# EAGLE design transistortester-mgr (EAGLE 5.07)
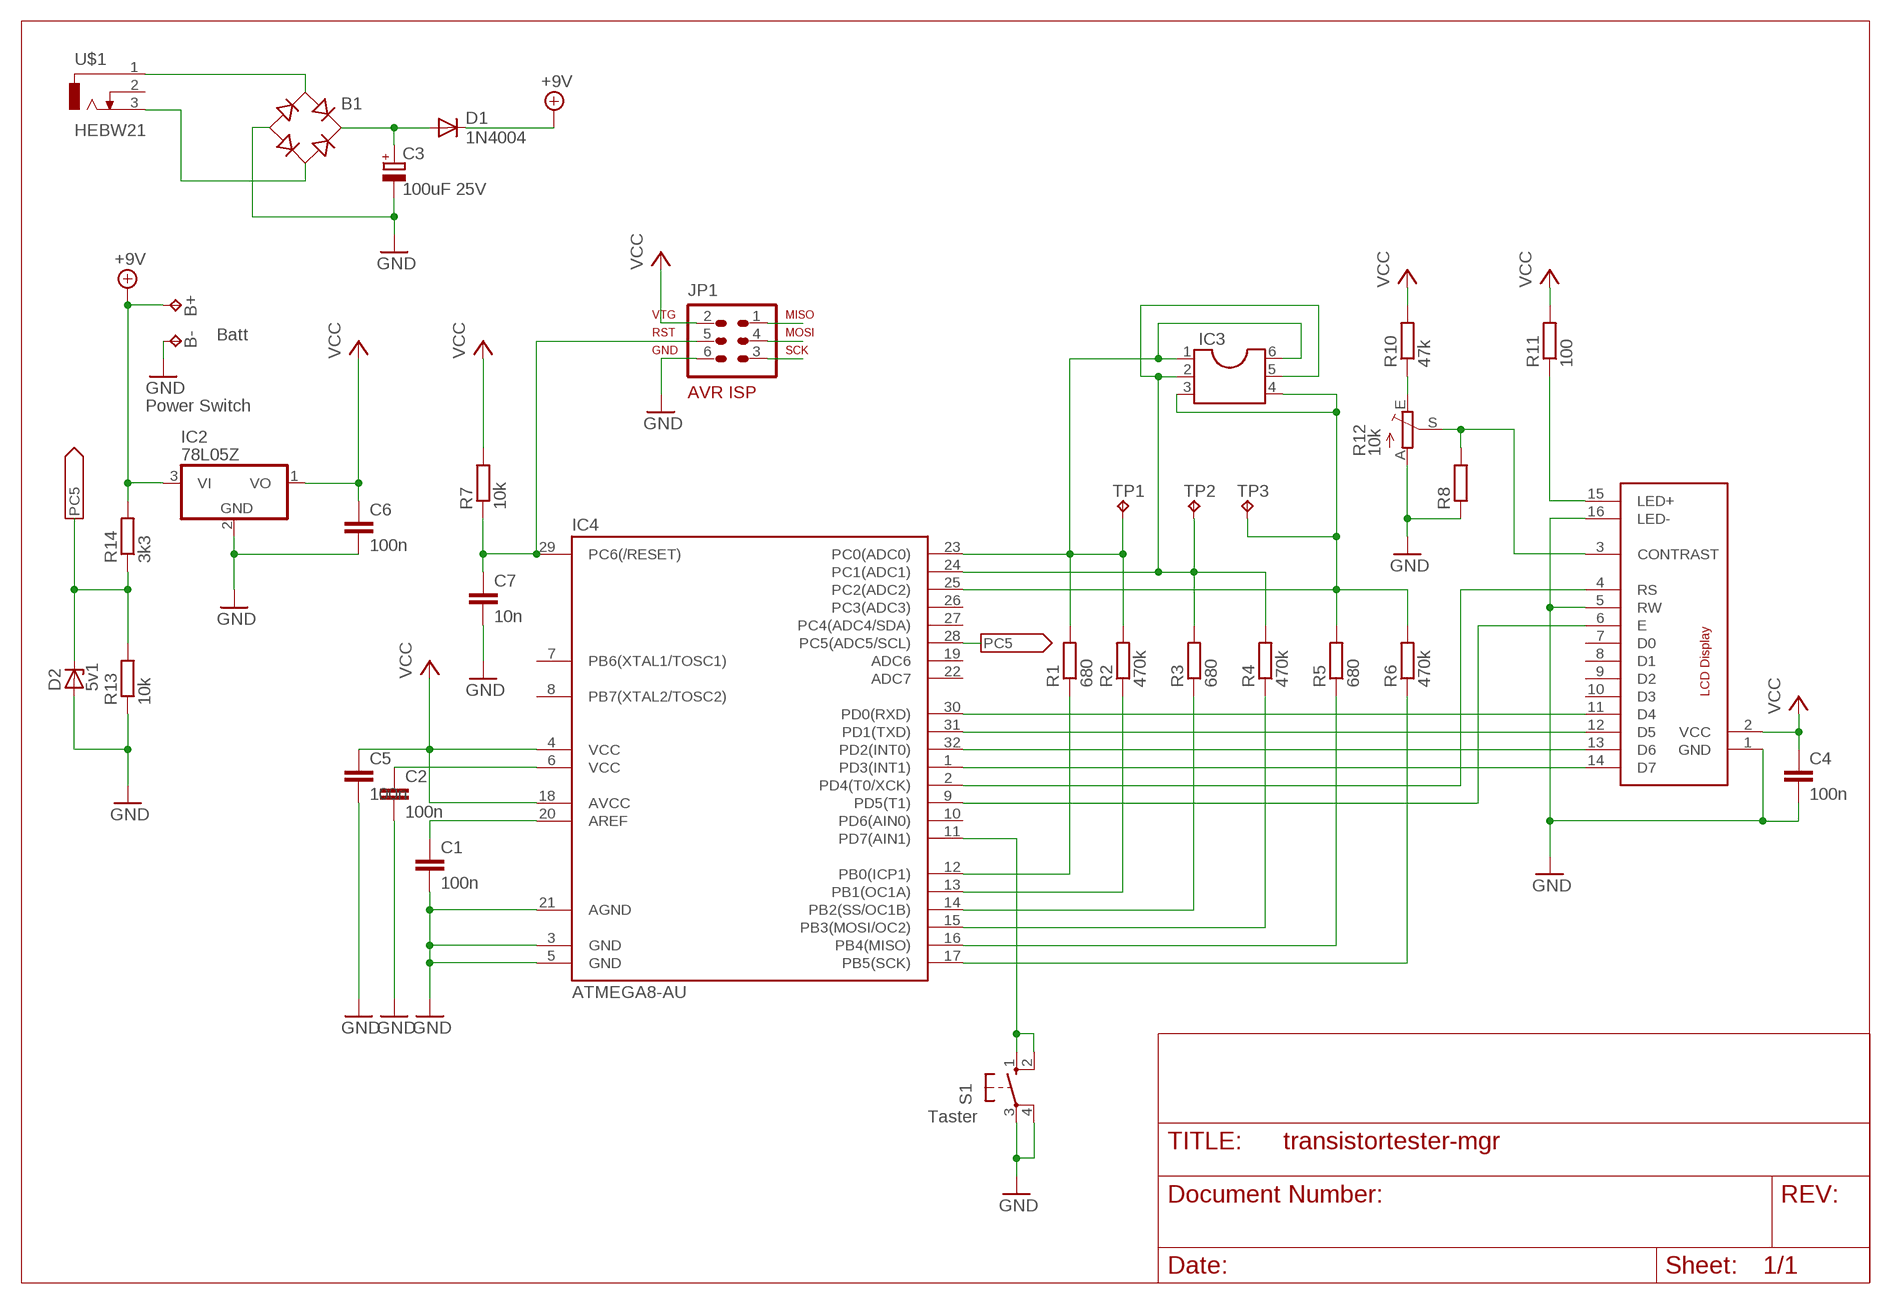
[diagram p0: schematic, sheet 1]

## Parts
B1  B-DIL  [B-DIL]
B+  TPPAD1-13Y  [P1-13Y]
B-  TPPAD1-13Y  [P1-13Y]
C1  100n  C-EUC0805  [C0805]
C2  100n  C-EUC0805  [C0805]
C3  100uF 25V  CPOL-EUE3.5-8  [E3,5-8]
C4  100n  C-EUC0805  [C0805]
C5  100n  C-EUC0805  [C0805]
C6  100n  C-EUC0805  [C0805]
C7  10n  C-EUC0805  [C0805]
D1  1N4004  [DO41-10]
D2  5v1  ZPD  [DO35Z10]
IC2  78L05Z  [TO92]
IC3  DIL6S  [SOCKET-06]
IC4  ATMEGA8-AU  [TQFP32-08]
JP1  AVR-ISP-6  [AVR-ISP-6]
LCD1  DISPLAYTECH-162JUMPER2ROWS  [PFOSTENSTECKER-16]
R1  680  R-EU_M1206  [M1206]
R2  470k  R-EU_M1206  [M1206]
R3  680  R-EU_M1206  [M1206]
R4  470k  R-EU_M1206  [M1206]
R5  680  R-EU_M1206  [M1206]
R6  470k  R-EU_M1206  [M1206]
R7  10k  R-EU_M1206  [M1206]
R8  R-EU_M1206  [M1206]
R10  47k  R-EU_M1206  [M1206]
R11  100  R-EU_M1206  [M1206]
R12  10k  TRIM_EU-LI10  [LI10]
R13  10k  R-EU_M1206  [M1206]
R14  3k3  R-EU_M1206  [M1206]
S1  10-XX  [B3F-10XX]
TP1  TPPAD1-13Y  [P1-13Y]
TP2  TPPAD1-13Y  [P1-13Y]
TP3  TPPAD1-13Y  [P1-13Y]
U$1  HEBW21  [P_HEBW21]

## Nets
+9V: B+.1(TP) D1.C IC2.3(VI) R14.2
E: IC4.9(PD5(T1)) LCD1.6(E)
GND: B1.- B-.1(TP) C1.2 C2.2 C3.- C4.2 C5.2 C6.2 C7.2 D2.A IC2.2(GND) IC4.3(GND) IC4.5(GND) IC4.21(AGND) JP1.6 LCD1.1(GND) LCD1.5(RW) LCD1.16(LED-) R8.1 R12.A R13.1 S1.3(P) S1.4(P1)
MISO: IC4.16(PB4(MISO)) JP1.1 R5.1
MOSI: IC4.15(PB3(MOSI/OC2)) JP1.4 R4.1
N$1: IC4.12(PB0(ICP1)) R1.1
N$2: IC4.13(PB1(OC1A)) R2.1
N$3: IC4.14(PB2(SS/OC1B)) R3.1
N$7: C7.1 IC4.29(PC6(/RESET)) JP1.5 R7.1
N$8: IC3.1 IC3.6 IC4.23(PC0(ADC0)) R1.2 R2.2 TP1.1(TP)
N$9: IC3.2 IC3.5 IC4.24(PC1(ADC1)) R3.2 R4.2 TP2.1(TP)
N$10: IC3.3 IC3.4 IC4.25(PC2(ADC2)) R5.2 R6.2 TP3.1(TP)
N$11: IC4.1(PD3(INT1)) LCD1.14(D7)
N$12: IC4.32(PD2(INT0)) LCD1.13(D6)
N$13: IC4.31(PD1(TXD)) LCD1.12(D5)
N$14: IC4.30(PD0(RXD)) LCD1.11(D4)
N$16: C1.1 IC4.20(AREF)
N$17: B1.AC1 U$1.1
N$18: R10.1 R12.E
N$19: LCD1.3(CONTRAST) R8.2 R12.S
N$23: B1.AC2 U$1.3
N$24: B1.+ C3.+ D1.A
N$25: C2.1 IC4.6(VCC)
N$27: IC4.11(PD7(AIN1)) S1.1(S) S1.2(S1)
N$28: LCD1.15(LED+) R11.1
PC5: D2.C IC4.28(PC5(ADC5/SCL)) R13.2 R14.1
RS: IC4.2(PD4(T0/XCK)) LCD1.4(RS)
SCK: IC4.17(PB5(SCK)) JP1.3 R6.1
VCC: C4.1 C5.1 C6.1 IC2.1(VO) IC4.4(VCC) IC4.18(AVCC) JP1.2 LCD1.2(VCC) R7.2 R10.2 R11.2
Unconnected: IC4.7(PB6(XTAL1/TOSC1)) IC4.8(PB7(XTAL2/TOSC2)) IC4.10(PD6(AIN0)) IC4.19(ADC6) IC4.22(ADC7) IC4.26(PC3(ADC3)) IC4.27(PC4(ADC4/SDA)) LCD1.7(D0) LCD1.8(D1) LCD1.9(D2) LCD1.10(D3) U$1.2

## Notes on the sheet
- Batt
- Power Switch
- Taster

## Library data of the parts
B1 = rectifier:B-DIL: RECTIFIER
B+ B- TP1-TP3 = testpad:TP: Test pad
C1 C2 C4-C7 = rcl:C-EU: CAPACITOR, European symbol
C3 = rcl:CPOL-EU: POLARIZED CAPACITOR, European symbol
D1 = diode:1N4004: DIODE general purpose rectifier, 1 A
D2 = diode:ZPD: Z DIODE 500 mW
IC2 = linear:78*: Positive VOLTAGE REGULATOR Source: http://cache.national.com/ds/LM/LM78L05.pdf http://www.fairchildsemi.com/ds/LM/LM7805.pdf
IC3 = ic-package:DIL6: Dual In Line / Socket
IC4 = atmega8:ATMEGA8
JP1 = atmel-1:AVR-ISP-6: AVR ISP-6 Serial Programming Header
LCD1 = ad:DISPLAYTECH-162: Displaytech 162 Reichelt LCD 162C LED or LCD 162C-BL HD44780 compatible LCD Display 2x16 Chars with LED backlight
R1-R8 R10 R11 R13 R14 = rcl:R-EU_: RESISTOR, European symbol
R12 = pot:TRIM_EU-: POTENTIOMETER
S1 = switch-omron:10-XX: OMRON SWITCH
U$1 = ad:HEBW21: Reichelt Hohlsteckerbuchse HEBW 21 oder HEBW 25

## Board
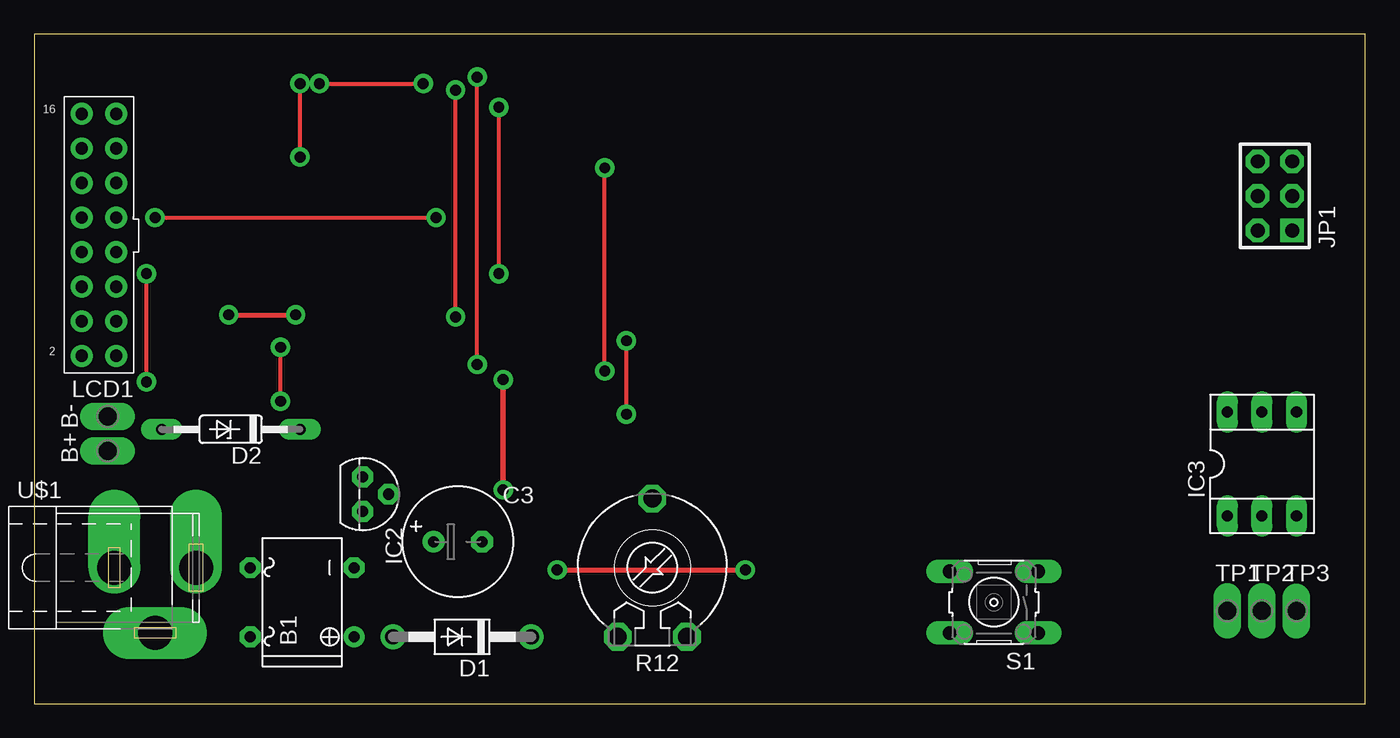
[diagram p1: board, top side]
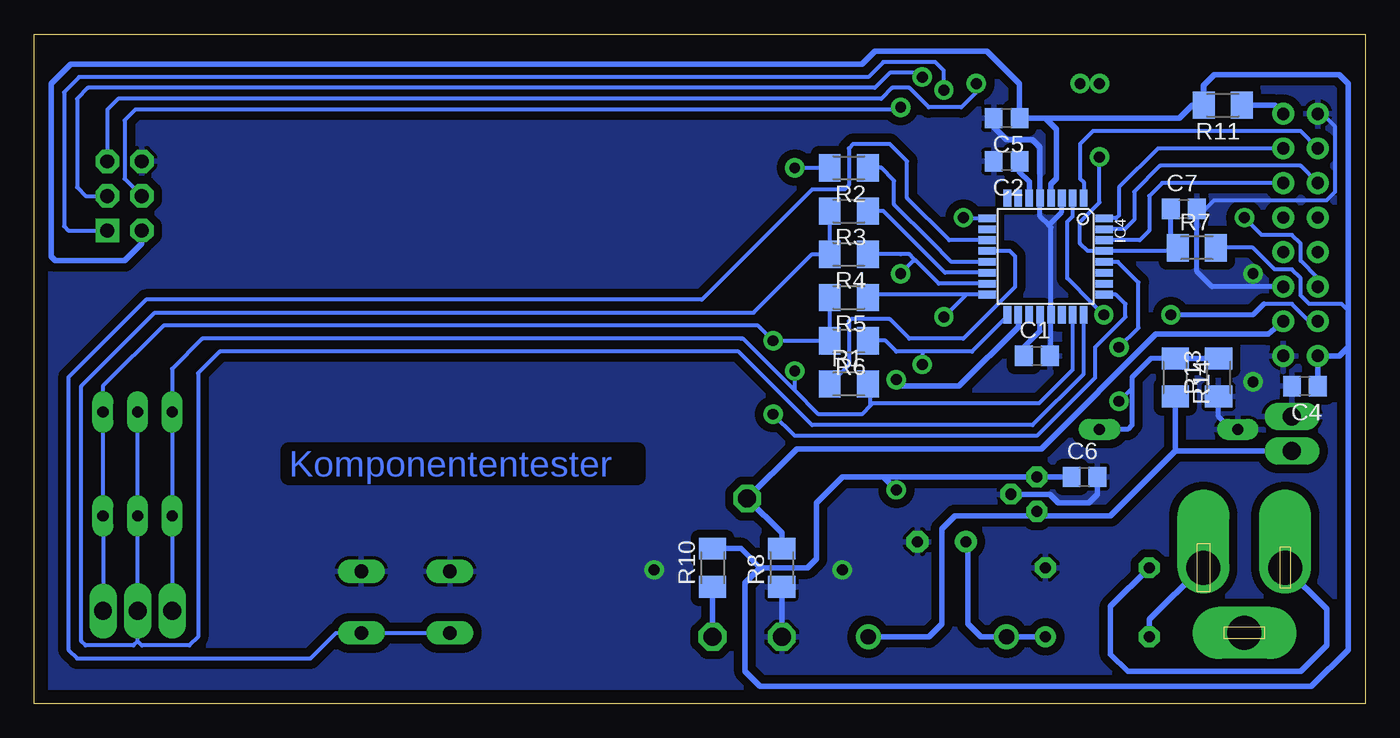
[diagram p2: board, bottom side, seen from below]

Size 97.77 x 49.2 mm. Coordinates in mm from the lower left corner, seen from the top.
Outline: 0,0 97.77,0 97.77,49.2 0,49.2 0,0
Copper layers (1*16): Top 0.035mm / dielectric 1.5mm / Bottom 0.035mm
Design rules "default *": minimum track width 10mil, minimum drill 20mil, track to track 8mil, track to pad 8mil, pad to pad 8mil, via to via 8mil, smd to smd 8mil, copper to edge 40mil, drill to drill 8mil, minimum pad ring 14mil, minimum via ring 8mil, stop-mask expansion 4mil, vias tented up to drill 0mil, thermal gap 10mil

### Footprints (pad centres in the part's own frame; a part is rotated, then mirrored left to right if it is on the bottom)
B-DIL = drill 0.813 round: + -2.54,-3.81 | drill 0.813 octagon: - 2.54,-3.81; AC1 2.54,3.81; AC2 -2.54,3.81
P1-13Y = drill 1.321 pad 1.905 long: 1 0,0
C0805 = smd 1.3 x 1.5: 1 -0.95,0; 2 0.95,0
E3,5-8 = drill 0.813 pad 1.6 round: + -1.778,0 | drill 0.813 pad 1.6 octagon: - 1.778,0
DO41-10 = drill 1.118 round: A 5.08,0; C -5.08,0
DO35Z10 = drill 0.813 long: A 5.08,0; C -5.08,0
TO92 = drill 0.813 octagon: 1 -1.27,0; 2 0,1.905; 3 1.27,0
SOCKET-06 = drill 0.813 long: 1 -2.54,-3.81; 2 0,-3.81; 3 2.54,-3.81; 4 2.54,3.81; 5 0,3.81; 6 -2.54,3.81
TQFP32-08 = smd 1.27 x 0.559: 1 -4.293,2.8; 2 -4.293,2; 3 -4.293,1.2; 4 -4.293,0.4; 5 -4.293,-0.4; 6 -4.293,-1.2; 7 -4.293,-2; 8 -4.293,-2.8; 17 4.293,-2.8; 18 4.293,-2; 19 4.293,-1.2; 20 4.293,-0.4; 21 4.293,0.4; 22 4.293,1.2; 23 4.293,2; 24 4.293,2.8 | smd 0.559 x 1.27: 9 -2.8,-4.293; 10 -2,-4.293; 11 -1.2,-4.293; 12 -0.4,-4.293; 13 0.4,-4.293; 14 1.2,-4.293; 15 2,-4.293; 16 2.8,-4.293; 25 2.8,4.293; 26 2,4.293; 27 1.2,4.293; 28 0.4,4.293; 29 -0.4,4.293; 30 -1.2,4.293; 31 -2,4.293; 32 -2.8,4.293
AVR-ISP-6 = drill 1.016 square: 1 -2.54,-1.27 | drill 1.016 octagon: 2 -2.54,1.27; 3 0,-1.27; 4 0,1.27; 5 2.54,-1.27; 6 2.54,1.27
PFOSTENSTECKER-16 = drill 0.9 round: 1 -1.27,8.89; 2 1.27,8.89; 3 -1.27,6.35; 4 1.27,6.35; 5 -1.27,3.81; 6 1.27,3.81; 7 -1.27,1.27; 8 1.27,1.27; 9 -1.27,-1.27; 10 1.27,-1.27; 11 -1.27,-3.81; 12 1.27,-3.81; 13 -1.27,-6.35; 14 1.27,-6.35; 15 -1.27,-8.89; 16 1.27,-8.89
M1206 = smd 1.6 x 2: 1 -1.4,0; 2 1.4,0
LI10 = drill 1.321 octagon: A -2.54,-5.08; E 2.54,-5.08; S 0,5.08
B3F-10XX = drill 1.016 long: 1 -3.251,2.261; 2 3.251,2.261; 3 -3.251,-2.261; 4 3.251,-2.261
P_HEBW21 = drill 2.5 pad 3.81 offset: 1 -3,0; 3 3,0 | drill 2.5 pad 3.81 long: 2 0,-4.8

### Placement (x,y rotation side)
B1  19.68,7.46 90 top
B+  5.4,18.57 90 top
B-  5.4,21.11 90 top
C1  24.13,25.56 0 bottom
C2  26.35,39.85 180 bottom
C3  31.11,11.91 0 top
C4  4.45,23.34 180 bottom
C5  26.35,43.02 180 bottom
C6  20.64,16.67 0 bottom
C7  13.34,36.35 0 bottom
D1  31.43,4.92 180 top
D2  14.45,20.16 180 top
IC2  24.13,15.4 270 top
IC3  90.17,17.62 0 top
IC4  23.5,32.86 270 bottom
JP1  91.12,37.31 90 top
LCD1  4.76,34.45 180 top
R1  37.94,23.5 0 bottom
R2  37.94,39.37 180 bottom
R3  37.94,36.2 180 bottom
R4  37.94,33.02 180 bottom
R5  37.94,29.85 180 bottom
R6  37.94,26.67 180 bottom
R7  12.38,33.5 0 bottom
R8  42.86,10 90 bottom
R10  47.94,10 90 bottom
R11  10.48,43.97 180 bottom
R12  45.4,10 0 top
R13  10.79,23.97 90 bottom
R14  13.97,23.97 270 bottom
S1  70.48,7.46 180 top
TP1  87.63,6.83 0 top
TP2  90.17,6.83 0 top
TP3  92.71,6.82 0 top
U$1  8.89,10 0 top

### Tracks (layer width: path | path; a pad name or v marks a point on that pad's centre or on a via)
+9V
  Bottom 0.406: 13.97,18.57 R14.2 | D1.C 32.07,4.92 31.11,5.87 31.11,12.86 30.16,13.81 24.45,13.81 IC2.3 23.81,13.81 18.73,13.81 13.97,18.57 | B+.1 13.97,18.57
E  (via drill 0.8 pad 1.42)
  Top 0.305: v8.89,35.72 v29.53,35.72
  Bottom 0.305: v8.89,35.72 7.62,34.45 5.4,34.45 4.76,33.81 4.76,32.54 3.49,31.27 LCD1.6 | IC4.9 29.48,35.67 v29.53,35.72
  Bottom 0.356: IC4.9
GND  (via drill 0.8 pad 1.42)
  Top 0.305: v8.26,23.65 v8.26,31.59
  Top 0.356: v38.42,9.84 v52.23,9.84
  Bottom 0.305: LCD1.16 3.17,43.34 2.22,42.39 2.22,37.62 2.86,36.99 11.11,36.99 11.75,36.35 C7.2
  Bottom 0.356: IC4.5 23.89,35.8 23.26,35.16 | R13.1 10.79,21.11 9.84,20.16 D2.A | C1.2 23.09,25.64 IC4.21 23.09,35 23.26,35.16 | LCD1.5 11.27,30.64 12.38,31.75 C7.2 | IC4.3 22.3,36.12 23.26,35.16
  Bottom 0.406: R12.A R8.1 | IC2.2 23.18,15.4 22.54,14.76 20.32,14.76 19.68,15.4 C6.2 | IC4.5 23.89,40.88 24.45,41.43 26.35,41.43 27.3,42.39 C5.2
  pour Bottom (isolate 0.61): 0,49.05 97.63,49.05 97.79,0 0.16,0
MISO  (via drill 0.8 pad 1.42)
  Top 0.305: v30.96,28.42 v30.96,45.09
  Bottom 0.305: JP1.1 95.25,34.77 95.57,35.08 95.57,44.93 94.61,45.88 | 94.61,45.88 | 94.61,45.88 94.46,46.04 36.51,46.04 35.4,47.15 31.59,47.15 30.96,46.51 v30.96,45.09 | 29.31,30.06 36.33,30.06 R5.1 | IC4.16 29.31,30.06 | 29.31,30.06 v30.96,28.42
MOSI  (via drill 0.8 pad 1.42)
  Top 0.305: v34.13,31.59 v34.13,43.81
  Bottom 0.305: IC4.15 31.34,30.86 33.02,32.54 | JP1.4 91.12,38.58 91.12,42.86 90.49,43.5 | 33.5,33.02 R4.1 | 33.02,32.54 33.18,32.7 | 90.49,43.5 | 90.49,43.5 90.33,43.66 34.29,43.66 v34.13,43.81 | 33.18,32.7 | 33.18,32.7 33.5,33.02 | 33.5,33.02 34.13,33.02 | 33.18,32.7 33.5,33.02 | 33.02,32.54 33.18,32.54 v34.13,31.59
N$1
  Bottom 0.305: IC4.12 26.12,33.26 25.72,32.86 25.72,30.64 29.53,26.83 33.5,26.83 34.92,28.26 37.78,28.26 37.94,28.1 37.94,24.89 R1.1
N$2
  Bottom 0.305: IC4.13 30.4,32.46 31.91,33.97 34.61,36.67 34.61,38.42 35.56,39.37 R2.1 | R2.1
N$3
  Bottom 0.305: IC4.14 30.87,31.66 32.7,33.5 | 32.7,33.5 | 32.7,33.5 35.4,36.2 R3.1 | R3.1
N$7  (via drill 0.8 pad 1.42)
  Top 0.305: v20.95,45.56 v28.57,45.56 | v19.53,40.16 v19.53,45.56
  Bottom 0.305: R7.1 14.02,33.26 IC4.29 20.4,33.26 20.95,33.81 20.95,35.4 19.53,36.83 v19.53,40.16 | JP1.5 92.39,43.66 91.6,44.45 35.56,44.45 34.77,45.24 33.5,45.24 32.07,43.81 29.69,43.81 28.57,44.93 v28.57,45.56 | v19.53,45.56 v20.95,45.56
  Bottom 0.356: C7.1 14.29,34 R7.1
N$8  (via drill 0.8 pad 1.42)
  Top 0.305: v41.91,24.45 v41.91,39.37
  Bottom 0.305: TP1.1 IC3.1 IC3.6 87.63,24.61 85.41,26.83 45.88,26.83 45.72,26.83 41.91,23.02 | IC4.23 21.5,24.54 23.97,22.07 36.2,22.07 36.35,21.91 | 36.35,21.91 36.35,23.31 R1.2 | R2.2 39.21,39.5 | R2.2 39.37,39.4 | R1.2 36.38,23.65 | 41.91,23.02 40.16,21.27 36.99,21.27 36.35,21.91 | R1.2 36.38,23.34 | 41.91,23.02 v41.91,24.45 | v41.91,39.37 R2.2 | R2.2
N$9
  Bottom 0.305: IC3.5 IC3.2 TP2.1 90.17,4.6 | R3.2 R4.2 40.64,33.02 44.93,28.73 88.9,28.73 94.3,23.34 94.3,4.6 93.98,4.29 90.49,4.29 90.17,4.6 | 90.17,4.6 89.85,4.29 86.36,4.29 85.72,4.92 85.72,24.29 84.14,25.88 46.04,25.88 40.64,20.48 24.45,20.48 20.7,24.23 IC4.24
N$10  (via drill 0.8 pad 1.42)
  Top 0.305: v43.5,21.27 v43.5,26.67
  Bottom 0.305: IC3.3 TP3.1 | IC3.3 IC3.4 92.71,23.34 88.27,27.78 44.61,27.78 v43.5,26.67 | R5.2 R6.2 v43.5,26.67 | v43.5,26.67 | v43.5,21.27 41.91,19.68 24.13,19.68 19.84,23.98 19.84,26.19 17.62,28.42 17.62,29.37 18.31,30.06 IC4.25
  Bottom 0.406: IC3.3
N$11
  Bottom 0.305: LCD1.14 4.76,42.07 20,42.07 20.95,41.12 20.95,38.58 20.7,38.32 IC4.1
N$12
  Bottom 0.305: 19.32,35.67 19.31,35.66 IC4.32 18.31,35.66 18.1,35.88 18.1,37.94 15.24,40.8 LCD1.13 | 19.32,35.67 19.37,35.72 19.21,35.72 19.32,35.67 | 19.32,35.67 19.37,35.67
N$13
  Bottom 0.305: LCD1.12 4.76,39.53 15.08,39.53 16.99,37.62 16.99,35.56 17.68,34.86 IC4.31
N$14
  Bottom 0.305: IC4.30 16.58,34.06 15.88,34.77 15.88,37.31 14.92,38.26 LCD1.11
N$16
  Bottom 0.356: IC4.20 23.89,27.38 25.08,26.19 C1.1
N$17
  Bottom 0.406: B1.AC1 18.73,7.14 18.73,3.65 17.46,2.38 4.76,2.38 2.86,4.29 2.86,6.99 5.87,10 U$1.1
N$18
  Bottom 0.406: R12.E R10.1
N$19
  Bottom 0.406: LCD1.3 7.14,27.15 15.4,27.15 23.81,18.73 41.75,18.73 R12.S 42.86,12.54 R8.2
N$23
  Bottom 0.406: U$1.3 12.06,10 15.88,6.19 B1.AC2
N$24
  Bottom 0.406: B1.+ D1.A 28.26,4.92 29.21,5.87 29.21,11.78 C3.+
N$25
  Bottom 0.406: IC4.6 24.7,38.35 25.4,39.05 C2.1
N$27
  Bottom 0.305: S1.2 S1.1 75.6,5.2 77.47,3.33 94.61,3.33 95.25,3.97 95.25,23.97 89.53,29.69 48.74,29.69 40.64,37.78 38.26,37.78 37.94,38.1 37.94,40.8 37.62,41.12 34.92,41.12 33.66,39.85 33.66,37.15 30.57,34.06 IC4.11
N$28
  Bottom 0.406: R11.1 6.67,43.97 LCD1.15
PC5  (via drill 0.8 pad 1.42)
  Top 0.305: v18.1,22.23 v18.1,26.19
  Bottom 0.305: 17.14,23.97 17.14,23.18 v18.1,22.23 | v18.1,26.19 16.67,27.62 16.67,30.96 18.17,32.46 IC4.28
  Bottom 0.356: R14.1 15.74,25.37 17.14,23.97 17.14,20.48 17.46,20.16 D2.C
  Bottom 0.406: R13.2 R14.1
RS  (via drill 0.8 pad 1.42)
  Top 0.356: v14.29,28.57 v19.21,28.57
  Bottom 0.305: IC4.2 21.5,35.81 21.75,35.56 | 21.75,35.56 | 21.75,35.56 21.91,35.4 21.91,31.27 20,29.37 | 20,29.37 | v19.21,28.57 20,29.37 | 7.46,29.37 5.4,29.37 4.13,28.1 LCD1.4
  Bottom 0.356: v14.29,28.57 8.26,28.57 7.46,29.37
SCK  (via drill 0.8 pad 1.42)
  Top 0.305: v32.54,24.92 v32.54,46.04
  Bottom 0.305: IC4.17 26.3,28.47 28.89,25.88 32.54,25.88 | JP1.3 93.98,37.31 94.61,37.94 94.61,44.45 93.82,45.24 36.04,45.24 34.92,46.35 32.86,46.35 v32.54,46.04 | 32.54,25.88 v32.54,24.92 | 32.54,25.88 34.45,25.88 35.24,26.67 R6.1 | v32.54,46.04
VCC  (via drill 0.8 pad 1.42)
  Top 0.406: v34.45,15.72 v34.45,23.81
  Bottom 0.305: R7.2 8.26,33.5 6.83,32.07 | 6.83,32.07 | 6.83,32.07 6.67,31.91 5.4,31.91 4.76,31.27 4.76,30 4.13,29.37 1.75,29.37 1.27,28.89
  Bottom 0.406: LCD1.2 C4.1 | LCD1.2 1.91,25.56 1.27,26.19 | 1.27,26.19 1.27,28.89 1.27,45.56 1.91,46.2 11.11,46.2 11.88,45.43 | R10.2 45.85,11.4 44.45,10 | 35.4,16.67 IC2.1 C6.1 | 35.4,16.67 38.42,16.67 40.32,14.76 40.32,10.64 40.96,10 44.45,10 | 11.88,45.43 R11.2 | R11.2 11.91,43.97 11.91,45.4 11.88,45.43 | IC4.18 25.5,27.69 29.84,23.34 34.13,23.34 v34.45,23.81 | 35.4,16.67 v34.45,15.72 | 1.27,26.19 1.27,3.97 3.97,1.27 44.45,1.27 45.56,2.38 45.56,8.89 44.45,10 | 23.5,43.02 13.65,43.02 12.7,43.97 R11.2 | 23.5,43.02 C5.1 25.4,45.56 27.78,47.94 30.48,47.94 36.04,47.94 36.99,46.99 95.09,46.99 96.52,45.56 96.52,32.86 96.2,32.54 91.12,32.54 89.85,33.81 JP1.2 | IC4.4 23.09,38.18 22.7,38.58 22.7,42.23 23.5,43.02
  Bottom 0.61: LCD1.2

### Text on the board
Bottom: Komponententester